# EAGLE design Driver Adapter (EAGLE 9.6.2)
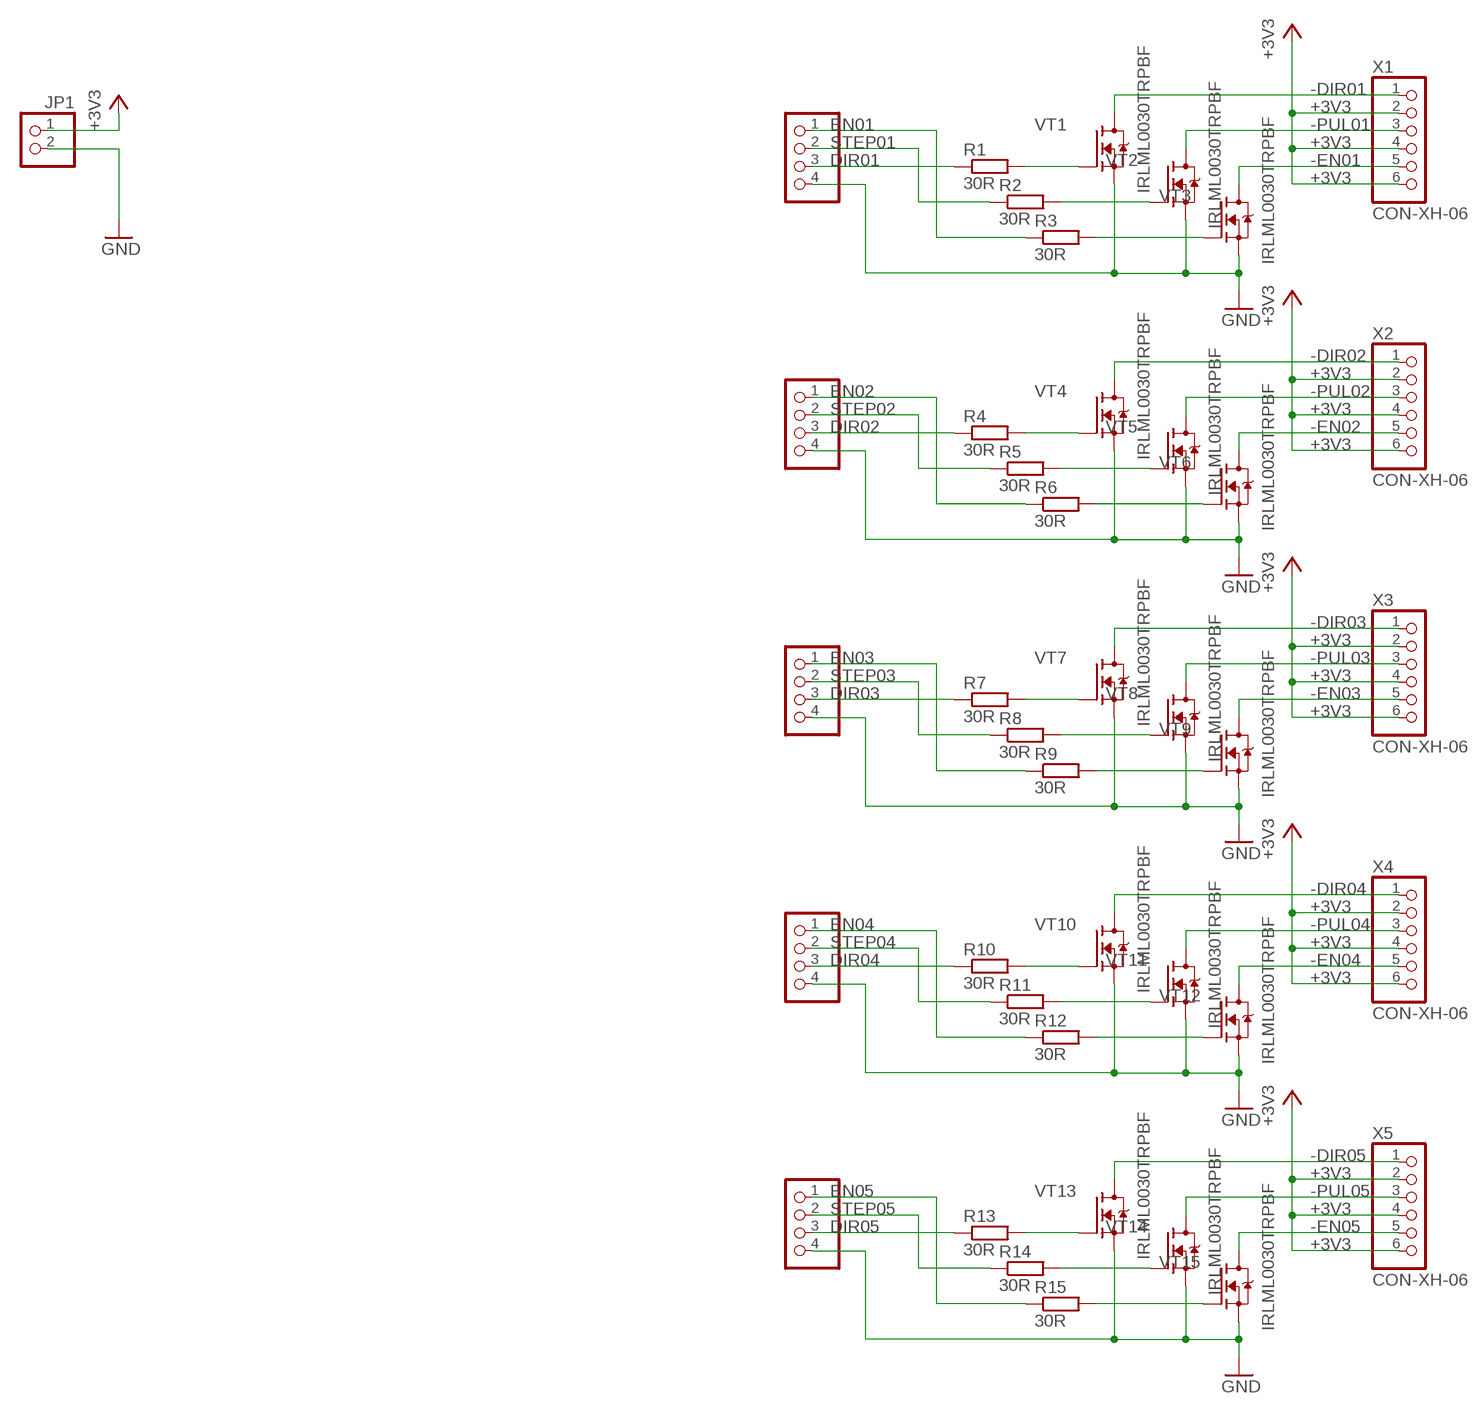
[diagram p0: schematic, sheet 1]

## Parts
JP1  PINHD-1X2  [1X02]
JP2  PINHD-1X4  [1X04]
JP3  PINHD-1X4  [1X04]
JP4  PINHD-1X4  [1X04]
JP5  PINHD-1X4  [1X04]
JP6  PINHD-1X4  [1X04]
R1  30R  R_R1206  [RESC3216X60]
R2  30R  R_R1206  [RESC3216X60]
R3  30R  R_R1206  [RESC3216X60]
R4  30R  R_R1206  [RESC3216X60]
R5  30R  R_R1206  [RESC3216X60]
R6  30R  R_R1206  [RESC3216X60]
R7  30R  R_R1206  [RESC3216X60]
R8  30R  R_R1206  [RESC3216X60]
R9  30R  R_R1206  [RESC3216X60]
R10  30R  R_R1206  [RESC3216X60]
R11  30R  R_R1206  [RESC3216X60]
R12  30R  R_R1206  [RESC3216X60]
R13  30R  R_R1206  [RESC3216X60]
R14  30R  R_R1206  [RESC3216X60]
R15  30R  R_R1206  [RESC3216X60]
VT1  IRLML0030TRPBF  FET-NSOT-23  [SOT95P240X115-3]
VT2  IRLML0030TRPBF  FET-NSOT-23  [SOT95P240X115-3]
VT3  IRLML0030TRPBF  FET-NSOT-23  [SOT95P240X115-3]
VT4  IRLML0030TRPBF  FET-NSOT-23  [SOT95P240X115-3]
VT5  IRLML0030TRPBF  FET-NSOT-23  [SOT95P240X115-3]
VT6  IRLML0030TRPBF  FET-NSOT-23  [SOT95P240X115-3]
VT7  IRLML0030TRPBF  FET-NSOT-23  [SOT95P240X115-3]
VT8  IRLML0030TRPBF  FET-NSOT-23  [SOT95P240X115-3]
VT9  IRLML0030TRPBF  FET-NSOT-23  [SOT95P240X115-3]
VT10  IRLML0030TRPBF  FET-NSOT-23  [SOT95P240X115-3]
VT11  IRLML0030TRPBF  FET-NSOT-23  [SOT95P240X115-3]
VT12  IRLML0030TRPBF  FET-NSOT-23  [SOT95P240X115-3]
VT13  IRLML0030TRPBF  FET-NSOT-23  [SOT95P240X115-3]
VT14  IRLML0030TRPBF  FET-NSOT-23  [SOT95P240X115-3]
VT15  IRLML0030TRPBF  FET-NSOT-23  [SOT95P240X115-3]
X1  CON-XH-06  [XH-06]
X2  CON-XH-06  [XH-06]
X3  CON-XH-06  [XH-06]
X4  CON-XH-06  [XH-06]
X5  CON-XH-06  [XH-06]

## Nets
+3V3: JP1.1 X1.2 X1.4 X1.6 X2.2 X2.4 X2.6 X3.2 X3.4 X3.6 X4.2 X4.4 X4.6 X5.2 X5.4 X5.6
-DIR01: VT1.3(D) X1.1
-DIR02: VT4.3(D) X2.1
-DIR03: VT7.3(D) X3.1
-DIR04: VT10.3(D) X4.1
-DIR05: VT13.3(D) X5.1
-EN01: VT3.3(D) X1.5
-EN02: VT6.3(D) X2.5
-EN03: VT9.3(D) X3.5
-EN04: VT12.3(D) X4.5
-EN05: VT15.3(D) X5.5
-PUL01: VT2.3(D) X1.3
-PUL02: VT5.3(D) X2.3
-PUL03: VT8.3(D) X3.3
-PUL04: VT11.3(D) X4.3
-PUL05: VT14.3(D) X5.3
DIR01: JP2.3 R1.1
DIR02: JP3.3 R4.1
DIR03: JP4.3 R7.1
DIR04: JP5.3 R10.1
DIR05: JP6.3 R13.1
EN01: JP2.1 R3.1
EN02: JP3.1 R6.1
EN03: JP4.1 R9.1
EN04: JP5.1 R12.1
EN05: JP6.1 R15.1
GND: JP1.2 JP2.4 JP3.4 JP4.4 JP5.4 JP6.4 VT1.2(S) VT2.2(S) VT3.2(S) VT4.2(S) VT5.2(S) VT6.2(S) VT7.2(S) VT8.2(S) VT9.2(S) VT10.2(S) VT11.2(S) VT12.2(S) VT13.2(S) VT14.2(S) VT15.2(S)
N$1: R1.2 VT1.1(G)
N$2: R2.2 VT2.1(G)
N$3: R3.2 VT3.1(G)
N$4: R4.2 VT4.1(G)
N$5: R5.2 VT5.1(G)
N$6: R6.2 VT6.1(G)
N$7: R7.2 VT7.1(G)
N$8: R8.2 VT8.1(G)
N$9: R9.2 VT9.1(G)
N$10: R10.2 VT10.1(G)
N$11: R11.2 VT11.1(G)
N$12: R12.2 VT12.1(G)
N$13: R13.2 VT13.1(G)
N$14: R14.2 VT14.1(G)
N$15: R15.2 VT15.1(G)
STEP01: JP2.2 R2.1
STEP02: JP3.2 R5.1
STEP03: JP4.2 R8.1
STEP04: JP5.2 R11.1
STEP05: JP6.2 R14.1

## Library data of the parts
JP1 = pinhead:PINHD-1X2: PIN HEADER
JP2-JP6 = pinhead:PINHD-1X4: PIN HEADER
R1-R15 = Flamberm:R_
VT1-VT15 = Flamberm:FET-N
X1-X5 = Flamberm:CON-XH-06

## Board
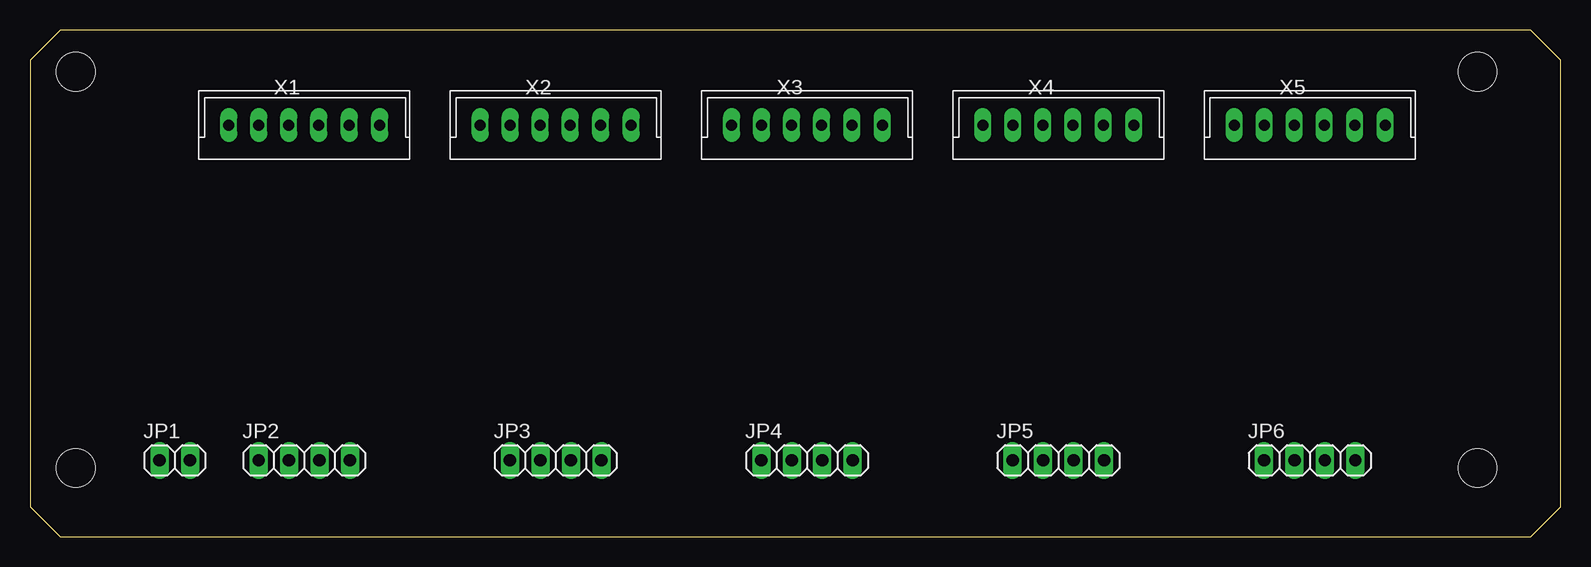
[diagram p1: board, top side]
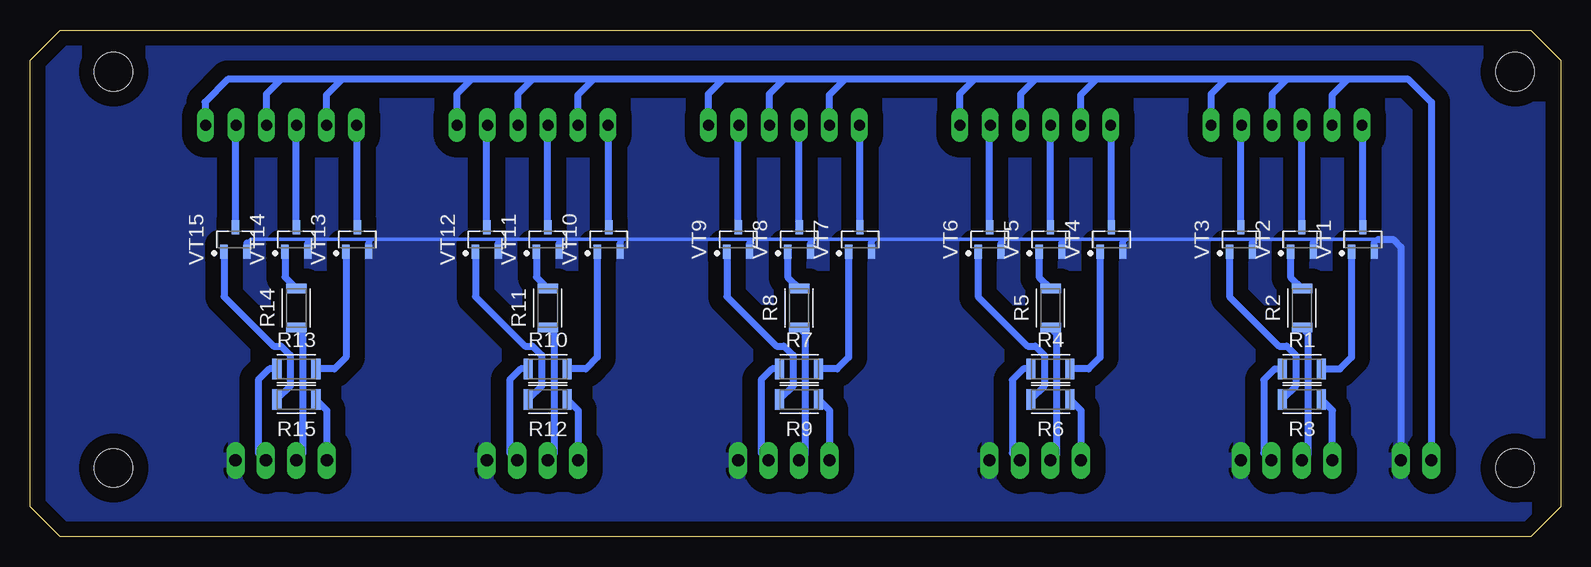
[diagram p2: board, bottom side, seen from below]

Size 127.61 x 42.22 mm. Coordinates in mm from the lower left corner, seen from the top.
Outline: 0,39.72 0,2.5 2.5,0 125.11,0 127.61,2.5 127.61,39.72 125.11,42.22 2.5,42.22 0,39.72
Copper layers (1*16): Top 0.035mm / dielectric 1.5mm / Bottom 0.035mm
Design rules "default": minimum track width 6mil, minimum drill 0.35mm, track to track 6mil, track to pad 6mil, pad to pad 6mil, via to via 6mil, smd to smd 6mil, copper to edge 40mil, drill to drill 6mil, minimum pad ring 10mil, minimum via ring 8mil, stop-mask expansion 4mil, vias tented up to drill 0mil, thermal gap 10mil
Holes 3.2 mm at 3.81,5.71 120.65,5.71 3.81,38.73 120.65,38.73

### Footprints (pad centres in the part's own frame; a part is rotated, then mirrored left to right if it is on the bottom)
1X02 = drill 1.016 long: 1 -1.27,0; 2 1.27,0
1X04 = drill 1.016 long: 1 -3.81,0; 2 -1.27,0; 3 1.27,0; 4 3.81,0
RESC3216X60 = smd 0.762 x 1.712: 1 -1.625,0; 2 1.625,0
SOT95P240X115-3 = smd 1.18 x 0.609: 1 -1.024,0.95; 2 -1.024,-0.95; 3 1.024,0
XH-06 = drill 0.9 long: 1 -6.29,0; 2 -3.79,0; 3 -1.29,0; 4 1.21,0; 5 3.75,0; 6 6.29,0

### Placement (x,y rotation side)
JP1  12.06,6.35 0 top
JP2  22.86,6.35 0 top
JP3  43.81,6.35 0 top
JP4  64.77,6.35 0 top
JP5  85.72,6.35 0 top
JP6  106.68,6.35 0 top
R1  21.59,13.97 0 bottom
R2  21.59,19.05 90 bottom
R3  21.59,11.43 180 bottom
R4  42.55,13.97 0 bottom
R5  42.55,19.05 90 bottom
R6  42.55,11.43 180 bottom
R7  63.5,13.97 0 bottom
R8  63.5,19.05 90 bottom
R9  63.5,11.43 180 bottom
R10  84.45,13.97 0 bottom
R11  84.45,19.05 90 bottom
R12  84.45,11.43 180 bottom
R13  105.41,13.97 0 bottom
R14  105.41,19.05 90 bottom
R15  105.41,11.43 180 bottom
VT1  16.51,24.76 90 bottom
VT2  21.59,24.76 90 bottom
VT3  26.67,24.76 90 bottom
VT4  37.47,24.76 90 bottom
VT5  42.55,24.76 90 bottom
VT6  47.62,24.76 90 bottom
VT7  58.42,24.76 90 bottom
VT8  63.5,24.76 90 bottom
VT9  68.58,24.76 90 bottom
VT10  79.38,24.76 90 bottom
VT11  84.45,24.76 90 bottom
VT12  89.53,24.76 90 bottom
VT13  100.33,24.76 90 bottom
VT14  105.41,24.76 90 bottom
VT15  110.49,24.76 90 bottom
X1  22.86,34.29 0 top
X2  43.81,34.29 0 top
X3  64.77,34.29 0 top
X4  85.72,34.29 0 top
X5  106.68,34.29 0 top

### Tracks (layer width: path | path; a pad name or v marks a point on that pad's centre or on a via)
+3V3
  Bottom 0.6: JP1.1 10.79,36.19 12.7,38.1 17.78,38.1 | 17.78,38.1 22.86,38.1 | 22.86,38.1 27.94,38.1 | 27.94,38.1 38.73,38.1 | 38.73,38.1 43.81,38.1 | 43.81,38.1 48.9,38.1 | 48.9,38.1 59.69,38.1 | 59.69,38.1 64.77,38.1 | 64.77,38.1 69.85,38.1 | 69.85,38.1 80.64,38.1 | 80.64,38.1 85.72,38.1 | 85.72,38.1 90.81,38.1 | 90.81,38.1 101.6,38.1 | 101.6,38.1 106.68,38.1 | 106.68,38.1 111.12,38.1 113.03,36.19 113.03,34.35 X5.6 | X5.4 107.89,36.89 106.68,38.1 | X5.2 102.89,36.81 101.6,38.1 | X4.6 92.02,36.89 90.81,38.1 | X4.4 86.94,36.89 85.72,38.1 | X4.2 81.94,36.81 80.64,38.1 | X3.6 71.06,36.89 69.85,38.1 | X3.4 65.98,36.89 64.77,38.1 | X3.2 60.98,36.81 59.69,38.1 | X2.6 50.1,36.89 48.9,38.1 | X2.4 45.02,36.89 43.81,38.1 | X2.2 40.02,36.81 38.73,38.1 | X1.6 29.15,36.89 27.94,38.1 | X1.4 24.07,36.89 22.86,38.1 | X1.2 19.07,36.81 17.78,38.1
-DIR01
  Bottom 0.6: VT1.3 16.51,34.23 X1.1
-DIR02
  Bottom 0.6: VT4.3 37.47,34.23 X2.1
-DIR03
  Bottom 0.6: VT7.3 58.42,34.23 X3.1
-DIR04
  Bottom 0.6: VT10.3 79.38,34.23 X4.1
-DIR05
  Bottom 0.6: VT13.3 100.33,34.23 X5.1
-EN01
  Bottom 0.6: VT3.3 26.67,34.23 X1.5
-EN02
  Bottom 0.6: VT6.3 47.62,34.23 X2.5
-EN03
  Bottom 0.6: VT9.3 68.58,34.23 X3.5
-EN04
  Bottom 0.6: VT12.3 89.53,34.23 X4.5
-EN05
  Bottom 0.6: VT15.3 110.49,34.23 X5.5
-PUL01
  Bottom 0.6: VT2.3 21.59,34.27 X1.3
-PUL02
  Bottom 0.6: VT5.3 42.55,34.27 X2.3
-PUL03
  Bottom 0.6: VT8.3 63.5,34.27 X3.3
-PUL04
  Bottom 0.6: VT11.3 84.45,34.27 X4.3
-PUL05
  Bottom 0.6: VT14.3 105.41,34.27 X5.3
DIR01
  Bottom 0.6: JP2.3 24.77,6.98 24.77,13.05 23.85,13.97 R1.1
DIR02
  Bottom 0.6: R4.1 44.8,13.97 45.72,13.05 45.72,6.98 JP3.3
DIR03
  Bottom 0.6: R7.1 65.76,13.97 66.67,13.05 66.67,6.98 JP4.3
DIR04
  Bottom 0.6: R10.1 86.72,13.97 87.63,13.05 87.63,6.98 JP5.3
DIR05
  Bottom 0.6: R13.1 107.67,13.97 108.58,13.05 108.58,6.98 JP6.3
EN01
  Bottom 0.6: JP2.1 19.05,10.51 R3.1
EN02
  Bottom 0.6: R6.1 40.01,10.51 JP3.1
EN03
  Bottom 0.6: R9.1 60.96,10.51 JP4.1
EN04
  Bottom 0.6: R12.1 81.92,10.51 JP5.1
EN05
  Bottom 0.6: R15.1 102.87,10.51 JP6.1
GND
  Bottom 0.305: 109.54,24.44 109.22,24.76 104.14,24.76 | 20.32,24.76 15.24,24.76 15.56,24.44 | 20.32,24.76 25.4,24.76 | 25.4,24.76 36.2,24.76 | 36.2,24.76 41.27,24.76 | 41.27,24.76 46.35,24.76 | 46.35,24.76 57.15,24.76 | 57.15,24.76 62.23,24.76 | 62.23,24.76 67.31,24.76 | 67.31,24.76 78.11,24.76 | 78.11,24.76 83.19,24.76 | 83.19,24.76 88.27,24.76 | 88.27,24.76 99.06,24.76 | 99.06,24.76 104.14,24.76 | 104.46,24.44 104.14,24.76 | 99.38,24.44 99.06,24.76 | 88.58,24.44 88.27,24.76 | 83.5,24.44 83.19,24.76 | 78.42,24.44 78.11,24.76 | 67.63,24.44 67.31,24.76 | 62.55,24.44 62.23,24.76 | 57.47,24.44 57.15,24.76 | 46.67,24.44 46.35,24.76 | 41.59,24.44 41.27,24.76 | 36.52,24.44 36.2,24.76 | 25.72,24.44 25.4,24.76 | 20.64,24.44 20.32,24.76
  Bottom 0.6: 109.54,24.44 VT15.2 | VT14.2 104.46,24.44 | VT13.2 99.38,24.44 | VT12.2 88.58,24.44 | VT11.2 83.5,24.44 | VT10.2 78.42,24.44 | VT9.2 67.63,24.44 | VT8.2 62.55,24.44 | VT7.2 57.47,24.44 | VT6.2 46.67,24.44 | VT5.2 41.59,24.44 | VT4.2 36.52,24.44 | VT3.2 25.72,24.44 | VT2.2 20.64,24.44 | VT1.2 15.56,24.44 | 15.24,24.76 13.97,24.76 13.34,24.13 JP1.2
  pour Bottom (isolate 1.27, rank 2): 0,0 0,42.55 127.64,42.55 127.64,0
N$1
  Bottom 0.6: VT1.1 17.46,14.92 18.41,13.97 R1.2
N$2
  Bottom 0.6: VT2.1 22.54,21.62 R2.2
N$3
  Bottom 0.6: VT3.1 27.62,20 23.5,15.88 22.86,15.88 22.1,15.11 22.1,12.55 R3.2
N$4
  Bottom 0.6: VT4.1 38.41,14.92 39.37,13.97 R4.2
N$5
  Bottom 0.6: VT5.1 43.49,21.62 R5.2
N$6
  Bottom 0.6: VT6.1 48.58,20 44.45,15.88 43.81,15.88 43.05,15.11 43.05,12.55 R6.2
N$7
  Bottom 0.6: VT7.1 59.37,14.92 60.33,13.97 R7.2
N$8
  Bottom 0.6: VT8.1 64.45,21.62 R8.2
N$9
  Bottom 0.6: VT9.1 69.53,20 65.41,15.88 64.77,15.88 64.01,15.11 64.01,12.55 R9.2
N$10
  Bottom 0.6: VT10.1 80.33,14.92 81.28,13.97 R10.2
N$11
  Bottom 0.6: VT11.1 85.41,21.62 R11.2
N$12
  Bottom 0.6: VT12.1 90.48,20 86.36,15.88 85.72,15.88 84.96,15.11 84.96,12.55 R12.2
N$13
  Bottom 0.6: VT13.1 101.28,14.92 102.23,13.97 R13.2
N$14
  Bottom 0.6: VT14.1 106.36,21.62 R14.2
N$15
  Bottom 0.6: VT15.1 111.44,20 107.31,15.88 106.68,15.88 105.92,15.11 105.92,12.55 R15.2
STEP01
  Bottom 0.6: R2.1 21.08,16.92 21.08,6.86 JP2.2
STEP02
  Bottom 0.6: JP3.2 42.04,6.86 42.04,16.92 R5.1
STEP03
  Bottom 0.6: R8.1 62.99,16.92 62.99,6.86 JP4.2
STEP04
  Bottom 0.6: R11.1 83.95,16.92 83.95,6.86 JP5.2
STEP05
  Bottom 0.6: R14.1 104.9,16.92 104.9,6.86 JP6.2